# EAGLE design WiFi_Button (EAGLE 9.6.2)
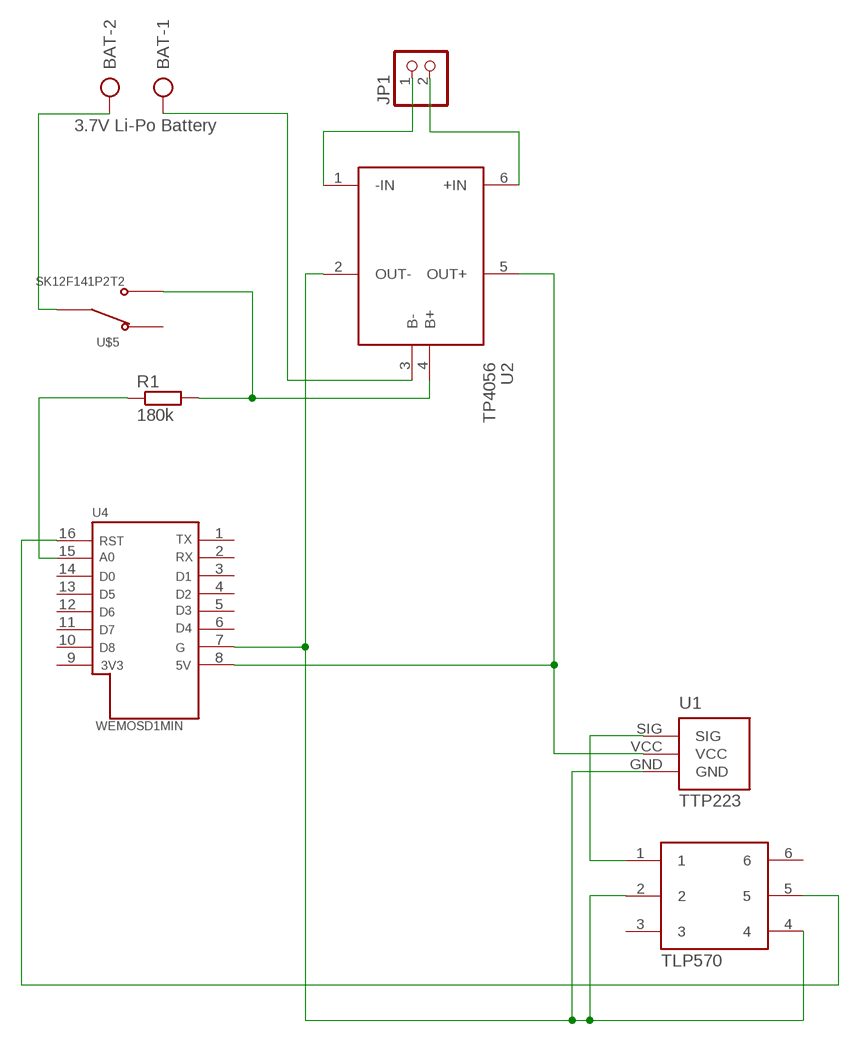
[diagram p0: schematic, sheet 1]

## Parts
BAT  AK500/2  [AK500/2]
JP1  PINHD-1X2  [1X02]
R1  180k  R-EU_0207/10  [0207/10]
U1  TTP223  [TTP223]
U2  TP4056  [TP4056]
U3  TLP570  [DIL06]
U4  WEMOSD1MIN  [WEMOSD1MIN]
U$5  SK12F141P2T2  [SK12F141P2T2]

## Nets
N$1: BAT.2 U$5.2
N$2: R1.2 U2.4(B+) U$5.3
N$3: BAT.1 U2.3(B-)
N$4: U1.VCC U2.5(OUT+) U4.8(5V)
N$5: U1.GND U2.2(OUT-) U3.2 U3.4 U4.7(G)
N$6: U1.SIG U3.1
N$7: U3.5 U4.16(RST)
N$8: JP1.1 U2.1(-IN)
N$9: JP1.2 U2.6(+IN)
N$10: R1.1 U4.15(A0)
Unconnected: U3.3 U3.6 U4.1(TX) U4.2(RX) U4.3(D1) U4.4(D2) U4.5(D3) U4.6(D4) U4.9(3V3) U4.10(D8) U4.11(D7) U4.12(D6) U4.13(D5) U4.14(D0) U$5.1

## Notes on the sheet
- 3.7V Li-Po Battery

## Library data of the parts
BAT = con-ptr500:AK500/2: CONNECTOR; OC_FARNELL: unknown; OC_NEWARK: unknown
JP1 = pinhead:PINHD-1X2: PIN HEADER
R1 = rcl:R-EU_: RESISTOR, European symbol; SPICEPREFIX: R
U1 = TTP223:TTP223
U2 = TP4056:TP4056
U3 = TLP570:TLP570
U4 = Wemos D1 Min:WEMOSD1MIN
U$5 = SK12F14 1P2T 2:SK12F141P2T2

## Board
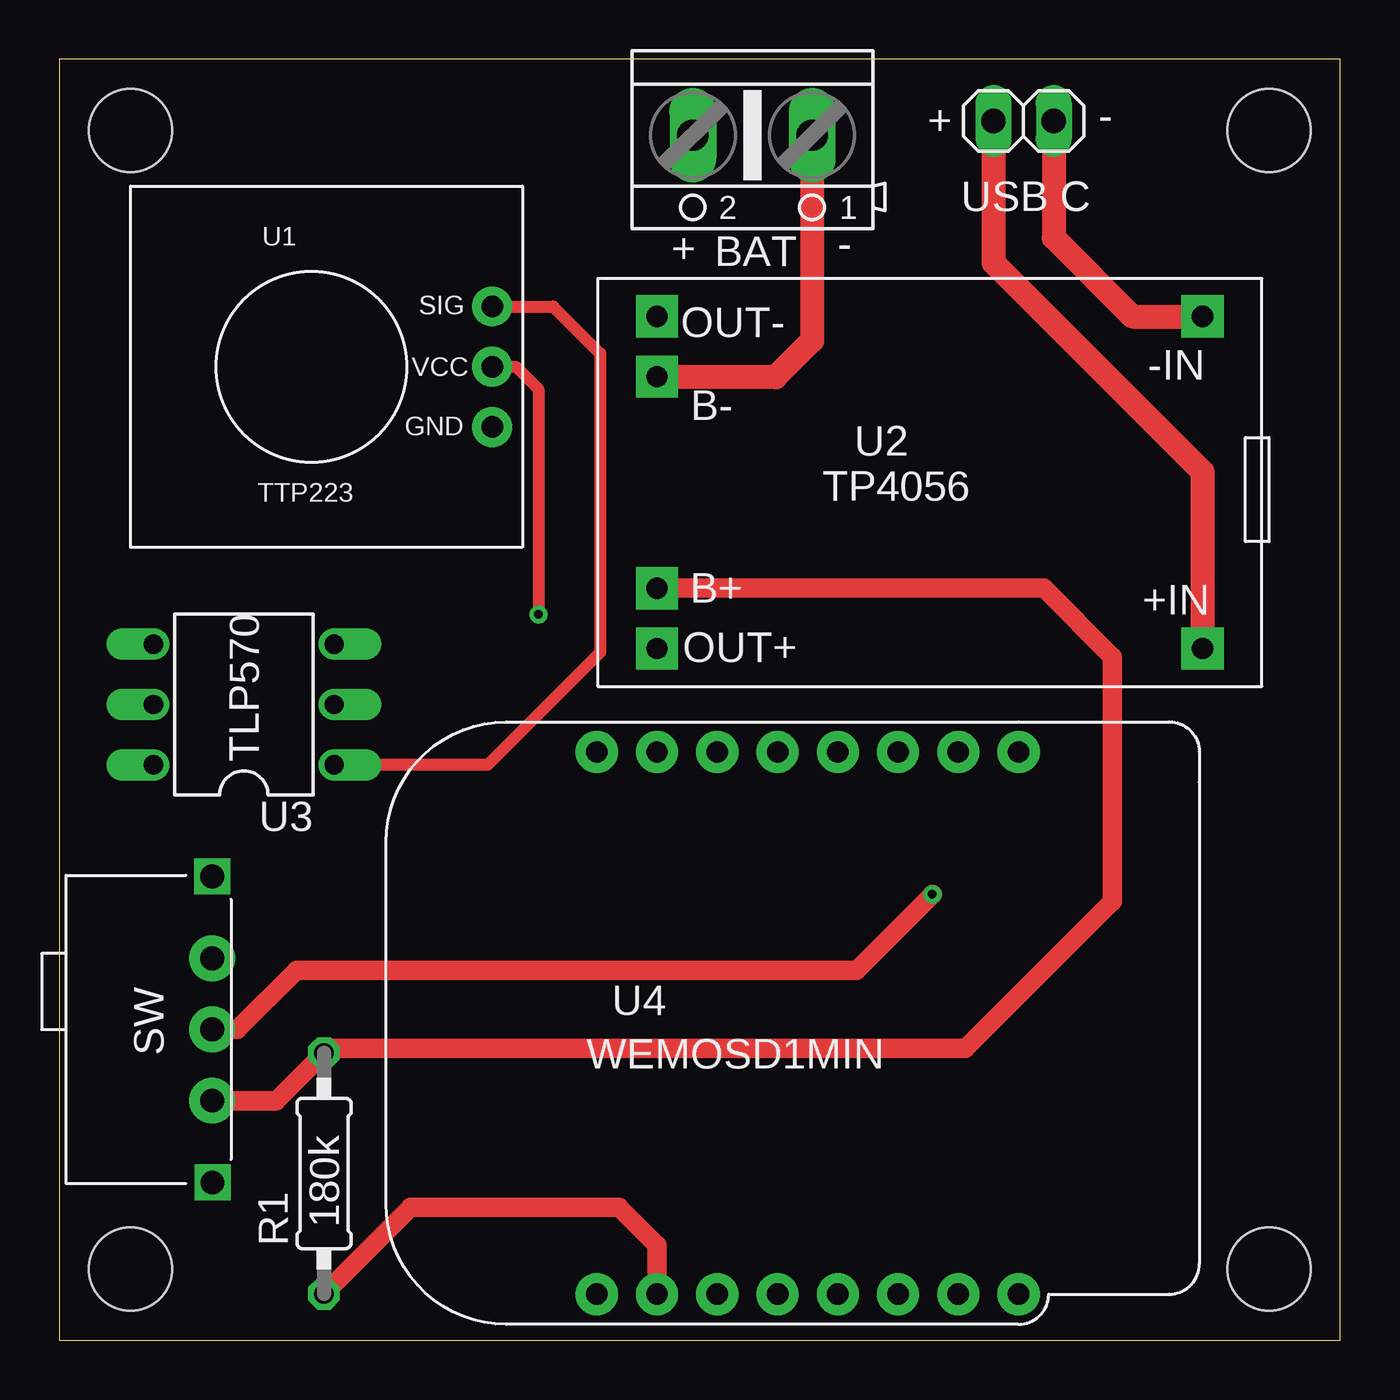
[diagram p1: board, top side]
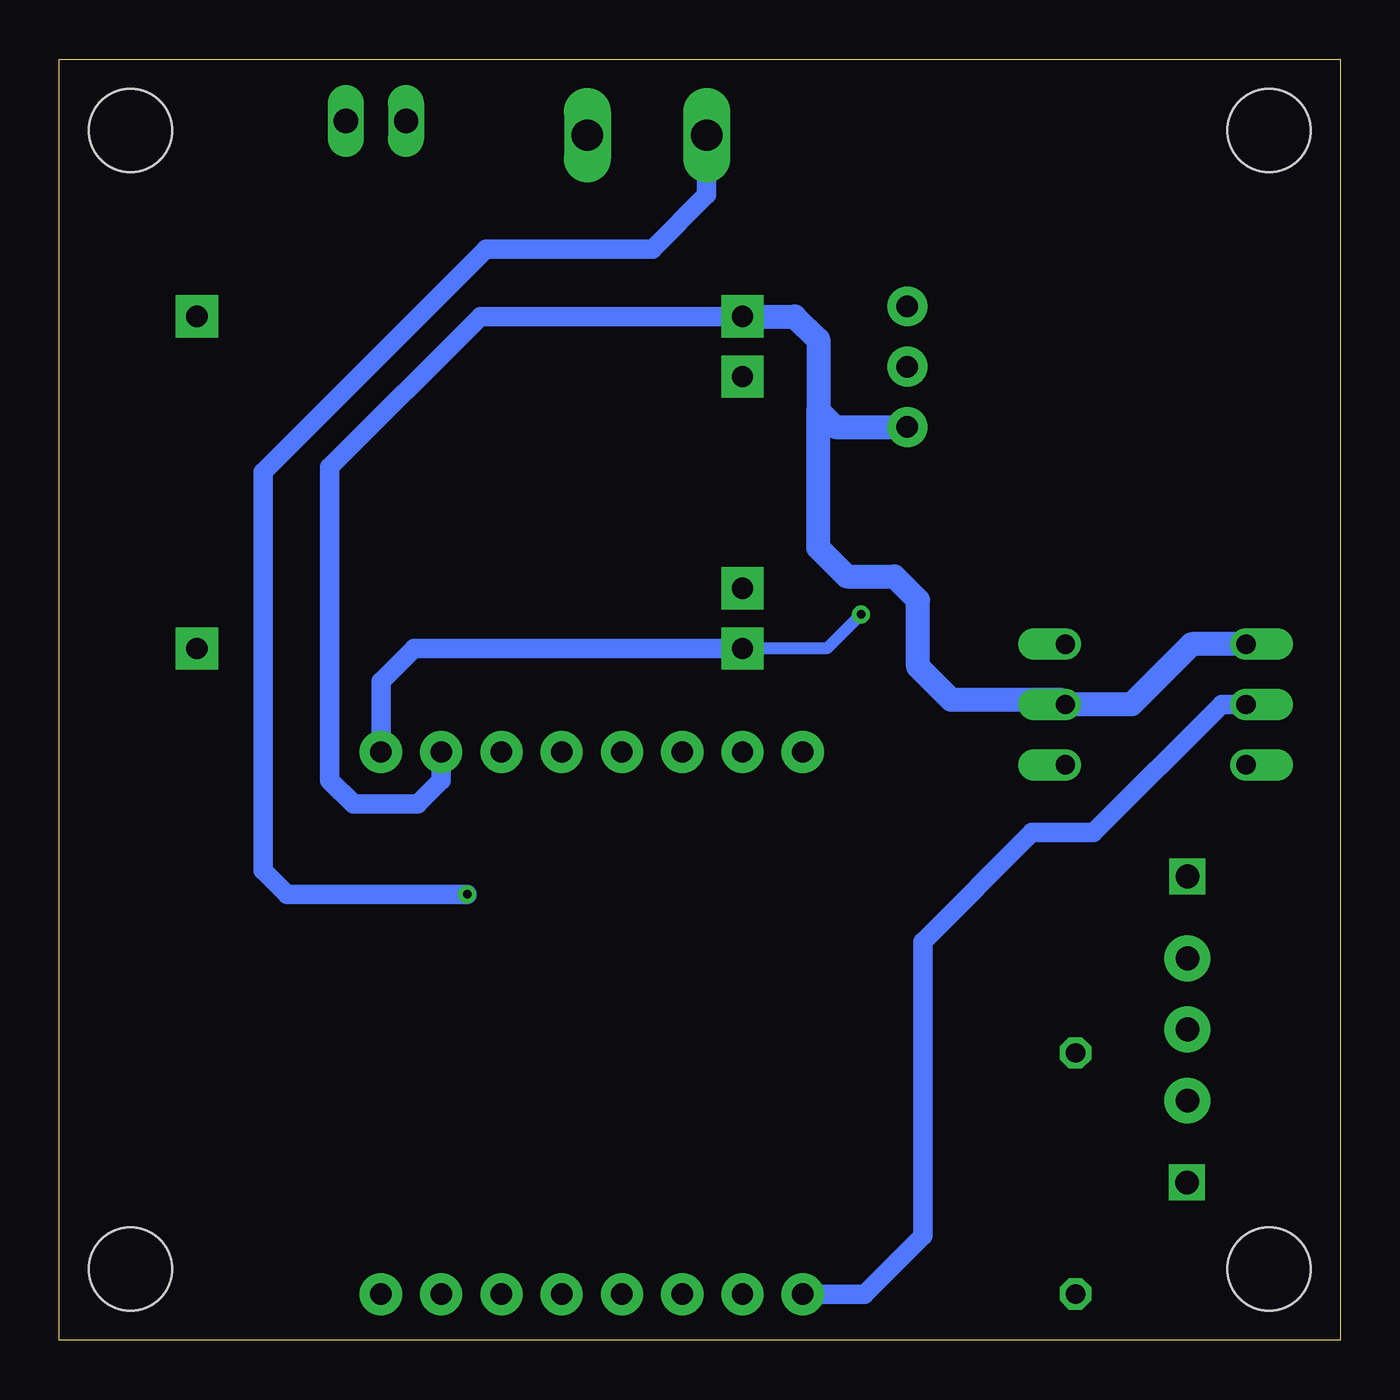
[diagram p2: board, bottom side, seen from below]

Size 54 x 54 mm. Coordinates in mm from the lower left corner, seen from the top.
Outline: 0,0 54,0 54,54 0,54 0,0
Copper layers (1*16): Top 0.035mm / dielectric 1.5mm / Bottom 0.035mm
Design rules "default *": minimum track width 6mil, minimum drill 0.35mm, track to track 6mil, track to pad 6mil, pad to pad 6mil, via to via 6mil, smd to smd 6mil, copper to edge 40mil, drill to drill 6mil, minimum pad ring 10mil, minimum via ring 8mil, stop-mask expansion 4mil, vias tented up to drill 15mil, thermal gap 10mil
Holes 3.5 mm at 51,3 3,51 51,51 3,3

### Footprints (pad centres in the part's own frame; a part is rotated, then mirrored left to right if it is on the bottom)
AK500/2 = drill 1.321 long: 1 -2.515,0; 2 2.515,0
1X02 = drill 1.016 long: 1 -1.27,0; 2 1.27,0
0207/10 = drill 0.813 octagon: 1 -5.08,0; 2 5.08,0
TTP223 = drill 0.9 pad 1.676: GND 0,-2.54; SIG 0,2.54; VCC 0,0
TP4056 = drill 0.9 pad 1.778 square: 1 -11.5,-7; 2 11.5,-7; 3 11.5,-4.46; 4 11.5,4.46; 5 11.5,7; 6 -11.5,7
DIL06 = drill 0.813 offset: 1 -2.54,-3.81; 2 0,-3.81; 3 2.54,-3.81; 4 2.54,3.81; 5 0,3.81; 6 -2.54,3.81
WEMOSD1MIN = drill 0.9 pad 1.778: 1 22.86,0; 2 22.86,-2.54; 3 22.86,-5.08; 4 22.86,-7.62; 5 22.86,-10.16; 6 22.86,-12.7; 7 22.86,-15.24; 8 22.86,-17.78; 9 0,-17.78; 10 0,-15.24; 11 0,-12.7; 12 0,-10.16; 13 0,-7.62; 14 0,-5.08; 15 0,-2.54; 16 0,0
SK12F141P2T2 = drill 1 pad 1.93: 1 -3,6.1; 2 0,6.1; 3 3,6.1 | drill 1 square: P$1 -6.45,6.1; P$2 6.45,6.12

### Placement (x,y rotation side)
BAT  29.22,50.8 180 top
JP1  40.65,51.4 180 top
R1  11.16,7.03 90 top
U1  18.25,41.04 0 top
U2  36.7,36.16 180 top
U3  7.78,26.8 90 top
U4  22.66,1.94 90 top
U$5  0.34,13.1 270 top

### Tracks (layer width: path | path; a pad name or v marks a point on that pad's centre or on a via)
N$1  (via drill 0.35)
  Top 0.813: U$5.2 7.5,13.1 10,15.6 33.6,15.6 v36.8,18.8
  Bottom 0.813: v36.8,18.8 44.4,18.8 45.4,19.8 45.4,36.6 36,46 29,46 26.7,48.3 BAT.2
N$2
  Top 0.813: U2.4 41.5,31.7 44.4,28.8 44.4,18.5 38.2,12.3 10.97,12.3 R1.2 9.15,10.1 U$5.3
N$3
  Top 1.016: BAT.1 31.73,42.13 30.2,40.6 25.22,40.6 U2.3
N$4  (via drill 0.35)
  Top 0.508: U1.VCC 19.25,41.04 20.2,40.09 v20.2,30.6
  Bottom 0.508: U2.5 21.64,29.16 v20.2,30.6
  Bottom 0.813: U2.5 39.04,29.16 40.44,27.76 U4.8
N$5
  Bottom 0.813: U4.7 37.9,23.6 38.9,22.6 41.6,22.6 42.6,23.6 42.6,36.8 36.24,43.16 U2.2
  Bottom 1.016: U2.2 23,43.16 22.04,42.2 22,42.2 22,39.2 | 22,39.2 21.3,38.5 U1.GND | 22,39.2 22,33.4 20.8,32.2 18.8,32.2 17.8,31.2 17.8,28.4 16.4,27 11.79,27 U3.2 8.8,26.8 6.26,29.34 U3.4
N$6
  Top 0.508: U1.SIG 20.82,43.58 22.8,41.6 22.8,29 18.06,24.26 U3.1
N$7
  Bottom 0.813: U4.16 20.06,1.94 17.6,4.4 17.6,16.8 13,21.4 10.4,21.4 5,26.8 U3.5
N$8
  Top 1.016: JP1.1 41.92,46.48 45.24,43.16 U2.1
N$9
  Top 1.016: JP1.2 39.38,45.42 48.2,36.6 U2.6
N$10
  Top 0.813: R1.1 14.81,5.6 23.6,5.6 25.2,4 U4.15

### Text on the board
tPlace: + | - | USB C | - | + | SW